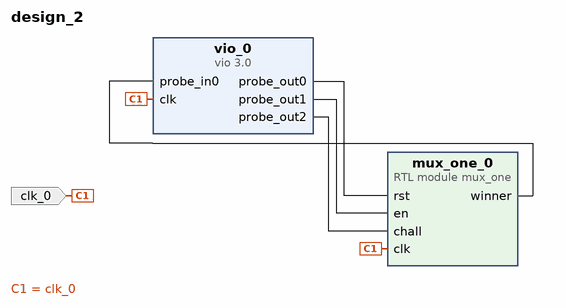
[diagram p0: block diagram of the top level]
# Vivado block design design_2, xc7a35tcpg236-1, Vivado 2020.1
create_bd_design design_2

create_bd_port -dir I -type clk clk_0

create_bd_cell -type module -reference mux_one mux_one_0
create_bd_cell -type ip -vlnv xilinx.com:ip:vio:3.0 vio_0
set_property -dict {CONFIG.C_NUM_PROBE_OUT 3 CONFIG.C_PROBE_OUT2_WIDTH 12 CONFIG.C_PROBE_OUT3_WIDTH 12} [get_bd_cells vio_0]

# ---- connections ----

connect_bd_net [get_bd_pins vio_0/probe_out0] [get_bd_pins mux_one_0/rst]
connect_bd_net [get_bd_pins vio_0/probe_out1] [get_bd_pins mux_one_0/en]
connect_bd_net [get_bd_pins vio_0/probe_out2] [get_bd_pins mux_one_0/chall]
connect_bd_net [get_bd_pins mux_one_0/winner] [get_bd_pins vio_0/probe_in0]
connect_bd_net -net clk_0_1 [get_bd_ports clk_0] [get_bd_pins mux_one_0/clk] [get_bd_pins vio_0/clk]

validate_bd_design
save_bd_design
